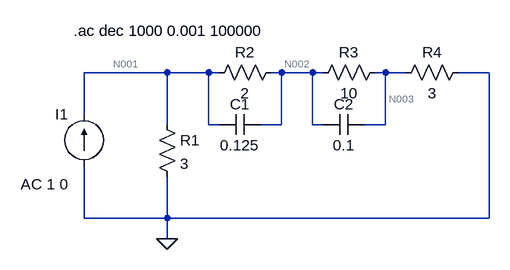
[diagram p0: schematic EJ1.asc]
EJ1.asc, the LTspice schematic file:
Version 4
SHEET 1 880 680
WIRE 112 112 -16 112
WIRE 176 112 112 112
WIRE 192 112 176 112
WIRE 288 112 272 112
WIRE 336 112 288 112
WIRE 352 112 336 112
WIRE 448 112 432 112
WIRE 480 112 448 112
WIRE 608 112 560 112
WIRE -16 176 -16 112
WIRE 112 192 112 112
WIRE 176 192 176 112
WIRE 192 192 176 192
WIRE 288 192 288 112
WIRE 288 192 256 192
WIRE 336 192 336 112
WIRE 352 192 336 192
WIRE 448 192 448 112
WIRE 448 192 416 192
WIRE -16 336 -16 256
WIRE 112 336 112 272
WIRE 112 336 -16 336
WIRE 608 336 608 112
WIRE 608 336 112 336
WIRE 112 368 112 336
FLAG 112 368 0
SYMBOL res 96 176 R0
SYMATTR InstName R1
SYMATTR Value 3
SYMBOL res 288 96 R90
WINDOW 0 0 56 VBottom 2
WINDOW 3 32 56 VTop 2
SYMATTR InstName R2
SYMATTR Value 2
SYMBOL res 448 96 R90
WINDOW 0 0 56 VBottom 2
WINDOW 3 32 56 VTop 2
SYMATTR InstName R3
SYMATTR Value 10
SYMBOL cap 256 176 R90
WINDOW 0 0 32 VBottom 2
WINDOW 3 32 32 VTop 2
SYMATTR InstName C1
SYMATTR Value 0.125
SYMBOL cap 416 176 R90
WINDOW 0 0 32 VBottom 2
WINDOW 3 32 32 VTop 2
SYMATTR InstName C2
SYMATTR Value 0.1
SYMBOL res 576 96 R90
WINDOW 0 0 56 VBottom 2
WINDOW 3 32 56 VTop 2
SYMATTR InstName R4
SYMATTR Value 3
SYMBOL current -16 256 R180
WINDOW 0 24 80 Left 2
WINDOW 3 24 0 Left 2
WINDOW 123 24 -28 Left 2
SYMATTR InstName I1
SYMATTR Value ""
SYMATTR Value2 AC 1 0
TEXT -32 48 Left 2 !.ac dec 1000 0.001 100000

The netlist it stands for:
* EJ1.asc
R1 N001 0 3
R2 N002 N001 2
R3 N003 N002 10
C1 N002 N001 0.125
C2 N003 N002 0.1
R4 0 N003 3
I1 0 N001 AC 1 0
.ac dec 1000 0.001 100000
.backanno
.end

* Results of the author's LTspice run, read from the files saved beside the schematic
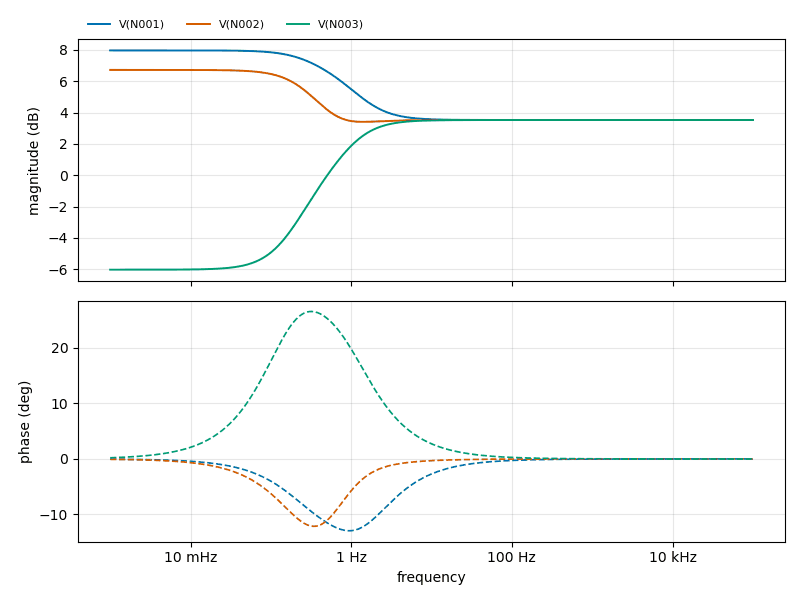
[diagram p1: AC Analysis of EJ1.asc, plotted from the saved traces]
* AC Analysis, 1 run:
*   V(N001): 7.96 dB at 1 mHz, 3.52 dB at 100 kHz, peak 7.96 dB at 1 mHz, 3 dB below the peak at 1.355 Hz
*   V(N002): 6.72 dB at 1 mHz, 3.52 dB at 100 kHz, peak 6.72 dB at 1 mHz, 3 dB below the peak at 699.2 mHz
*   V(N003): -6.02 dB at 1 mHz, 3.52 dB at 100 kHz, peak 3.52 dB at 100 kHz, 3 dB below the peak at 595.5 mHz